# Altium project FMC_ADC_100M_10B_16CHA_TDC.PrjPCB (part 5 of 5)
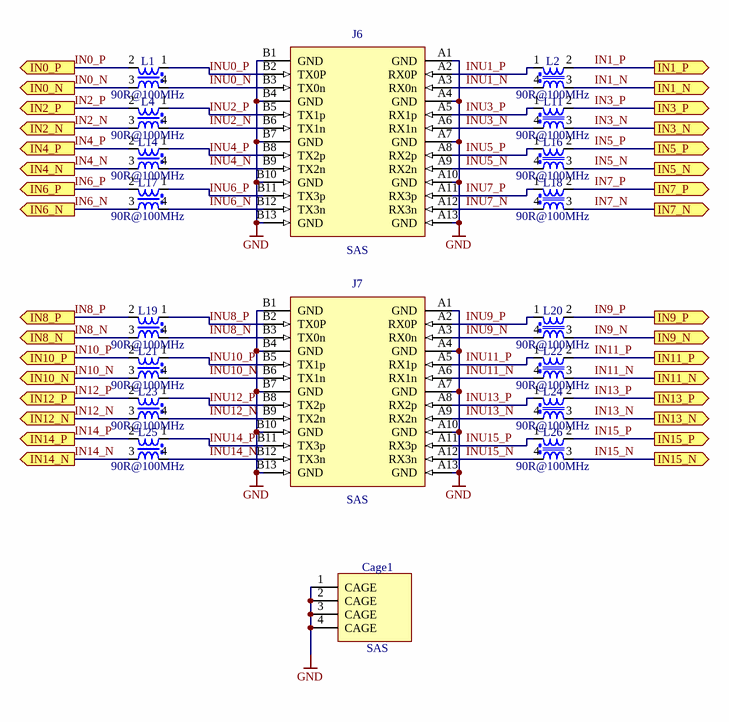
[diagram p12: SAS_Connectors.SchDoc]

## Nets that join several sheets
3P3VAUX: EEPROM_Temp (12 pins), FMC connector (J9.d32)
DVDD33: U_TDC0 (7 pins), power_supply (L8.2), IDX_CTRL (C103.1 C104.1 D1.2 IC17.8), U_TDC1 (7 pins), U_TDC2 (7 pins), U_TDC3 (7 pins), U_CFD0 (C26A.1 IC15A.5), DACs (9 pins), U_CFD1 (C26B.1 IC15B.5), U_CFD2 (C26C.1 IC15C.5), U_CFD3 (C26D.1 IC15D.5), U_CFD4 (C26E.1 IC15E.5), U_CFD5 (C26F.1 IC15F.5), U_CFD6 (C26G.1 IC15G.5), U_CFD7 (C26H.1 IC15H.5), U_CFD8 (C26I.1 IC15I.5), U_CFD9 (C26J.1 IC15J.5), U_CFD10 (C26K.1 IC15K.5), U_CFD11 (C26L.1 IC15L.5), U_CFD12 (C26M.1 IC15M.5), U_CFD13 (C26N.1 IC15N.5), U_CFD14 (C26O.1 IC15O.5), U_CFD15 (C26P.1 IC15P.5), Translators (9 pins)
GND: FMC_ADC_100M_10B_16CHA_TDC (J2.2 R3.1), U_ADC0 (19 pins), U_TDC0 (24 pins), Clock_circuit (34 pins), EEPROM_Temp (14 pins), FMC connector (164 pins), power_supply (58 pins), IDX_CTRL (9 pins), U_TDC1 (24 pins), U_TDC2 (24 pins), U_TDC3 (24 pins), U_CFD0 (10 pins), DACs (18 pins), U_CFD1 (10 pins), U_CFD2 (10 pins), U_CFD3 (10 pins), U_CFD4 (10 pins), U_CFD5 (10 pins), U_CFD6 (10 pins), U_CFD7 (10 pins), U_CFD8 (10 pins), U_CFD9 (10 pins), U_CFD10 (10 pins), U_CFD11 (10 pins), U_CFD12 (10 pins), U_CFD13 (10 pins), U_CFD14 (10 pins), U_CFD15 (10 pins), U_ADC1 (19 pins), Translators (18 pins), SAS_Connectors (24 pins)
N3V0A: power_supply (L30.2 TP9.1), U_CFD0 (C24A.1 IC22A.6), U_CFD1 (C24B.1 IC22B.6), U_CFD2 (C24C.1 IC22C.6), U_CFD3 (C24D.1 IC22D.6), U_CFD4 (C24E.1 IC22E.6), U_CFD5 (C24F.1 IC22F.6), U_CFD6 (C24G.1 IC22G.6), U_CFD7 (C24H.1 IC22H.6), U_CFD8 (C24I.1 IC22I.6), U_CFD9 (C24J.1 IC22J.6), U_CFD10 (C24K.1 IC22K.6), U_CFD11 (C24L.1 IC22L.6), U_CFD12 (C24M.1 IC22M.6), U_CFD13 (C24N.1 IC22N.6), U_CFD14 (C24O.1 IC22O.6), U_CFD15 (C24P.1 IC22P.6)
P1V8: U_ADC0 (C3A.2 IC1A.35 IC4A.5 L12A.1), Clock_circuit (L10.1), power_supply (8 pins), IDX_CTRL (L31.1), U_ADC1 (C3B.2 IC1B.35 IC4B.5 L12B.1), Translators (C66.1 C79.1 IC25.11 IC27.11)
P3V3: FMC connector (5 pins), power_supply (8 pins)
P3V3_CLK: Clock_circuit (38 pins), power_supply (L5.2 TP4.1)
P5V0A: power_supply (L9.2 TP2.1), U_CFD0 (C23A.1 IC22A.3), U_CFD1 (C23B.1 IC22B.3), U_CFD2 (C23C.1 IC22C.3), U_CFD3 (C23D.1 IC22D.3), U_CFD4 (C23E.1 IC22E.3), U_CFD5 (C23F.1 IC22F.3), U_CFD6 (C23G.1 IC22G.3), U_CFD7 (C23H.1 IC22H.3), U_CFD8 (C23I.1 IC22I.3), U_CFD9 (C23J.1 IC22J.3), U_CFD10 (C23K.1 IC22K.3), U_CFD11 (C23L.1 IC22L.3), U_CFD12 (C23M.1 IC22M.3), U_CFD13 (C23N.1 IC22N.3), U_CFD14 (C23O.1 IC22O.3), U_CFD15 (C23P.1 IC22P.3)
P12V0: FMC connector (J9.c35 J9.c37), power_supply (7 pins)
REF2V5: FMC_ADC_100M_10B_16CHA_TDC (R2.1), DACs (C87.1 IC18.8 IC19.8 IC20.2)
VADJ: FMC connector (J9.e39 J9.f40 J9.g39 J9.h40), power_supply (R49.1), Translators (19 pins)
ADC_CLK_N: U_ADC0 (C2A.1 R1A.1), Clock_circuit (IC3.41)
ADC_CLK_N: Clock_circuit (IC3.38), U_ADC1 (C2B.1 R1B.1)
ADC_CLK_P: U_ADC0 (C1A.1 R1A.2), Clock_circuit (IC3.40)
ADC_CLK_P: Clock_circuit (IC3.37), U_ADC1 (C1B.1 R1B.2)
ADC_IN0.SIG_N: U_ADC0 (IC1A.2), U_CFD0 (C27A.1 R25A.2)
ADC_IN0.SIG_P: U_ADC0 (IC1A.1), U_CFD0 (R7A.2 R21A.2)
ADC_IN1.SIG_N: U_ADC0 (IC1A.5), U_CFD1 (C27B.1 R25B.2)
ADC_IN1.SIG_P: U_ADC0 (IC1A.4), U_CFD1 (R7B.2 R21B.2)
ADC_IN2.SIG_N: U_ADC0 (IC1A.8), U_CFD2 (C27C.1 R25C.2)
ADC_IN2.SIG_P: U_ADC0 (IC1A.7), U_CFD2 (R7C.2 R21C.2)
ADC_IN3.SIG_N: U_ADC0 (IC1A.11), U_CFD3 (C27D.1 R25D.2)
ADC_IN3.SIG_P: U_ADC0 (IC1A.10), U_CFD3 (R7D.2 R21D.2)
ADC_IN4.SIG_N: U_ADC0 (IC1A.39), U_CFD4 (C27E.1 R25E.2)
ADC_IN4.SIG_P: U_ADC0 (IC1A.38), U_CFD4 (R7E.2 R21E.2)
ADC_IN5.SIG_N: U_ADC0 (IC1A.42), U_CFD5 (C27F.1 R25F.2)
ADC_IN5.SIG_P: U_ADC0 (IC1A.41), U_CFD5 (R7F.2 R21F.2)
ADC_IN6.SIG_N: U_ADC0 (IC1A.45), U_CFD6 (C27G.1 R25G.2)
ADC_IN6.SIG_P: U_ADC0 (IC1A.44), U_CFD6 (R7G.2 R21G.2)
ADC_IN7.SIG_N: U_ADC0 (IC1A.48), U_CFD7 (C27H.1 R25H.2)
ADC_IN7.SIG_P: U_ADC0 (IC1A.47), U_CFD7 (R7H.2 R21H.2)
ADC_IN8.SIG_N: U_CFD8 (C27I.1 R25I.2), U_ADC1 (IC1B.2)
ADC_IN8.SIG_P: U_CFD8 (R7I.2 R21I.2), U_ADC1 (IC1B.1)
ADC_IN9.SIG_N: U_CFD9 (C27J.1 R25J.2), U_ADC1 (IC1B.5)
ADC_IN9.SIG_P: U_CFD9 (R7J.2 R21J.2), U_ADC1 (IC1B.4)
ADC_IN10.SIG_N: U_CFD10 (C27K.1 R25K.2), U_ADC1 (IC1B.8)
ADC_IN10.SIG_P: U_CFD10 (R7K.2 R21K.2), U_ADC1 (IC1B.7)
ADC_IN11.SIG_N: U_CFD11 (C27L.1 R25L.2), U_ADC1 (IC1B.11)
ADC_IN11.SIG_P: U_CFD11 (R7L.2 R21L.2), U_ADC1 (IC1B.10)
ADC_IN12.SIG_N: U_CFD12 (C27M.1 R25M.2), U_ADC1 (IC1B.39)
ADC_IN12.SIG_P: U_CFD12 (R7M.2 R21M.2), U_ADC1 (IC1B.38)
ADC_IN13.SIG_N: U_CFD13 (C27N.1 R25N.2), U_ADC1 (IC1B.42)
ADC_IN13.SIG_P: U_CFD13 (R7N.2 R21N.2), U_ADC1 (IC1B.41)
ADC_IN14.SIG_N: U_CFD14 (C27O.1 R25O.2), U_ADC1 (IC1B.45)
ADC_IN14.SIG_P: U_CFD14 (R7O.2 R21O.2), U_ADC1 (IC1B.44)
ADC_IN15.SIG_N: U_CFD15 (C27P.1 R25P.2), U_ADC1 (IC1B.48)
ADC_IN15.SIG_P: U_CFD15 (R7P.2 R21P.2), U_ADC1 (IC1B.47)
ADC_MISO: U_ADC0 (IC4A.4), U_ADC1 (IC4B.4), Translators (IC21.7)
ADC_MISO_VADJ: FMC connector (J9.h16), Translators (IC21.5 TP16.1)
ADC_MOSI: U_ADC0 (IC1A.62), U_ADC1 (IC1B.62), Translators (IC21.8)
ADC_MOSI_VADJ: FMC connector (J9.h17), Translators (IC21.4 TP11.1)
ADC_RESETn_1V8: U_ADC0 (IC1A.64), U_ADC1 (IC1B.64), Translators (IC25.10)
ADC_SCK: U_ADC0 (IC1A.63), U_ADC1 (IC1B.63), Translators (IC21.9)
ADC_SCK_VADJ: FMC connector (J9.h32), Translators (IC21.3 IC28.4 R178.1 TP10.1)
ADC_SSN0: U_ADC0 (IC1A.61 IC4A.1), Translators (IC21.10)
ADC_SSN0_VADJ: FMC connector (J9.c14), Translators (IC21.2 TP29.1)
ADC_SSN1: U_ADC1 (IC1B.61 IC4B.1), Translators (IC25.7)
ADC_SSN1_VADJ: FMC connector (J9.c15), Translators (IC25.5 TP20.1)
ADC_SYNC_1V8: U_ADC0 (IC1A.49), U_ADC1 (IC1B.49), Translators (IC27.10)
ADCLK_N: U_ADC0 (IC1A.24), FMC connector (J9.g7)
ADCLK_N: FMC connector (J9.d21), U_ADC1 (IC1B.24)
ADCLK_P: U_ADC0 (IC1A.23), FMC connector (J9.g6)
ADCLK_P: FMC connector (J9.d20), U_ADC1 (IC1B.23)
CFD_CLAMP: FMC_ADC_100M_10B_16CHA_TDC (R2.2 R3.2), U_CFD0 (IC22A.7), U_CFD1 (IC22B.7), U_CFD2 (IC22C.7), U_CFD3 (IC22D.7), U_CFD4 (IC22E.7), U_CFD5 (IC22F.7), U_CFD6 (IC22G.7), U_CFD7 (IC22H.7), U_CFD8 (IC22I.7), U_CFD9 (IC22J.7), U_CFD10 (IC22K.7), U_CFD11 (IC22L.7), U_CFD12 (IC22M.7), U_CFD13 (IC22N.7), U_CFD14 (IC22O.7), U_CFD15 (IC22P.7)
CFD_OFFSET0: U_CFD0 (R120A.1), DACs (IC18.3)
CFD_OFFSET1: DACs (IC18.16), U_CFD1 (R120B.1)
CFD_OFFSET2: DACs (IC18.4), U_CFD2 (R120C.1)
CFD_OFFSET3: DACs (IC18.15), U_CFD3 (R120D.1)
CFD_OFFSET4: DACs (IC18.5), U_CFD4 (R120E.1)
CFD_OFFSET5: DACs (IC18.14), U_CFD5 (R120F.1)
CFD_OFFSET6: DACs (IC18.6), U_CFD6 (R120G.1)
CFD_OFFSET7: DACs (IC18.13), U_CFD7 (R120H.1)
CFD_OFFSET8: DACs (IC19.3), U_CFD8 (R120I.1)
CFD_OFFSET9: DACs (IC19.16), U_CFD9 (R120J.1)
CFD_OFFSET10: DACs (IC19.4), U_CFD10 (R120K.1)
CFD_OFFSET11: DACs (IC19.15), U_CFD11 (R120L.1)
CFD_OFFSET12: DACs (IC19.5), U_CFD12 (R120M.1)
CFD_OFFSET13: DACs (IC19.14), U_CFD13 (R120N.1)
CFD_OFFSET14: DACs (IC19.6), U_CFD14 (R120O.1)
CFD_OFFSET15: DACs (IC19.13), U_CFD15 (R120P.1)
CFD_OUT0.SIG_N: U_TDC0 (IC8A.48 R126A.2), U_CFD0 (IC15A.3)
CFD_OUT0.SIG_P: U_TDC0 (IC8A.33 IC8A.47 R126A.1 R129A.1), U_CFD0 (IC15A.4), U_CFD3 (IC15D.4)
CFD_OUT1.SIG_N: U_TDC0 (IC8A.46 R127A.2), U_CFD1 (IC15B.3)
CFD_OUT1.SIG_P: U_TDC0 (IC8A.45 R127A.1), U_CFD1 (IC15B.4)
CFD_OUT2.SIG_N: U_TDC0 (IC8A.36 R128A.2), U_CFD2 (IC15C.3)
CFD_OUT2.SIG_P: U_TDC0 (IC8A.35 R128A.1), U_CFD2 (IC15C.4)
CFD_OUT3.SIG_N: U_TDC0 (IC8A.34 R129A.2), U_CFD3 (IC15D.3)
CFD_OUT4.SIG_N: U_TDC1 (IC8B.48 R126B.2), U_CFD4 (IC15E.3)
CFD_OUT4.SIG_P: U_TDC1 (IC8B.33 IC8B.47 R126B.1 R129B.1), U_CFD4 (IC15E.4), U_CFD7 (IC15H.4)
CFD_OUT5.SIG_N: U_TDC1 (IC8B.46 R127B.2), U_CFD5 (IC15F.3)
CFD_OUT5.SIG_P: U_TDC1 (IC8B.45 R127B.1), U_CFD5 (IC15F.4)
CFD_OUT6.SIG_N: U_TDC1 (IC8B.36 R128B.2), U_CFD6 (IC15G.3)
CFD_OUT6.SIG_P: U_TDC1 (IC8B.35 R128B.1), U_CFD6 (IC15G.4)
CFD_OUT7.SIG_N: U_TDC1 (IC8B.34 R129B.2), U_CFD7 (IC15H.3)
CFD_OUT8.SIG_N: U_TDC2 (IC8C.48 R126C.2), U_CFD8 (IC15I.3)
CFD_OUT9.SIG_N: U_TDC2 (IC8C.46 R127C.2), U_CFD9 (IC15J.3)
CFD_OUT9.SIG_P: U_TDC2 (IC8C.45 R127C.1), U_CFD9 (IC15J.4)
CFD_OUT10.SIG_N: U_TDC2 (IC8C.36 R128C.2), U_CFD10 (IC15K.3)
CFD_OUT10.SIG_P: U_TDC2 (IC8C.35 R128C.1), U_CFD10 (IC15K.4)
CFD_OUT11.SIG_N: U_TDC2 (IC8C.34 R129C.2), U_CFD11 (IC15L.3)
CFD_OUT11.SIG_P: U_TDC2 (IC8C.33 IC8C.47 R126C.1 R129C.1), U_CFD8 (IC15I.4), U_CFD11 (IC15L.4)
CFD_OUT12.SIG_N: U_TDC3 (IC8D.48 R126D.2), U_CFD12 (IC15M.3)
CFD_OUT12.SIG_P: U_TDC3 (IC8D.33 IC8D.47 R126D.1 R129D.1), U_CFD12 (IC15M.4), U_CFD15 (IC15P.4)
CFD_OUT13.SIG_N: U_TDC3 (IC8D.46 R127D.2), U_CFD13 (IC15N.3)
CFD_OUT13.SIG_P: U_TDC3 (IC8D.45 R127D.1), U_CFD13 (IC15N.4)
CFD_OUT14.SIG_N: U_TDC3 (IC8D.36 R128D.2), U_CFD14 (IC15O.3)
CFD_OUT14.SIG_P: U_TDC3 (IC8D.35 R128D.1), U_CFD14 (IC15O.4)
CFD_OUT15.SIG_N: U_TDC3 (IC8D.34 R129D.2), U_CFD15 (IC15P.3)
CLK0_M2C_N: Clock_circuit (IC3.32), FMC connector (J9.h5)
CLK0_M2C_P: Clock_circuit (IC3.31), FMC connector (J9.h4)
CLK1_M2C_N: Clock_circuit (IC3.35), FMC connector (J9.g3)
CLK1_M2C_P: Clock_circuit (IC3.34), FMC connector (J9.g2)
DISABLE_N: U_TDC0 (IC8A.39 R125A.2), FMC connector (J9.e19)
DISABLE_N: FMC connector (J9.j22), U_TDC2 (IC8C.39 R125C.2)
DISABLE_N: FMC connector (J9.k20), U_TDC1 (IC8B.39 R125B.2)
DISABLE_N: FMC connector (J9.k23), U_TDC3 (IC8D.39 R125D.2)
DISABLE_P: U_TDC0 (IC8A.38 R125A.1), FMC connector (J9.e18)
DISABLE_P: FMC connector (J9.j21), U_TDC2 (IC8C.38 R125C.1)
DISABLE_P: FMC connector (J9.k19), U_TDC1 (IC8B.38 R125B.1)
DISABLE_P: FMC connector (J9.k22), U_TDC3 (IC8D.38 R125D.1)
FRAME0_N: U_TDC0 (IC8A.1), FMC connector (J9.j19)
FRAME0_N: FMC connector (J9.e10), U_TDC3 (IC8D.1)
FRAME0_N: FMC connector (J9.f23), U_TDC2 (IC8C.1)
FRAME0_N: FMC connector (J9.k35), U_TDC1 (IC8B.1)
FRAME0_P: U_TDC0 (IC8A.2), FMC connector (J9.j18)
FRAME0_P: FMC connector (J9.e9), U_TDC3 (IC8D.2)
FRAME0_P: FMC connector (J9.f22), U_TDC2 (IC8C.2)
FRAME0_P: FMC connector (J9.k34), U_TDC1 (IC8B.2)
FRAME1_N: U_TDC0 (IC8A.5), FMC connector (J9.f17)
FRAME1_N: FMC connector (J9.f26), U_TDC2 (IC8C.5)
FRAME1_N: FMC connector (J9.j10), U_TDC3 (IC8D.5)
FRAME1_N: FMC connector (J9.j34), U_TDC1 (IC8B.5)
FRAME1_P: U_TDC0 (IC8A.6), FMC connector (J9.f16)
FRAME1_P: FMC connector (J9.f25), U_TDC2 (IC8C.6)
FRAME1_P: FMC connector (J9.j9), U_TDC3 (IC8D.6)
FRAME1_P: FMC connector (J9.j33), U_TDC1 (IC8B.6)
FRAME2_N: U_TDC0 (IC8A.9), FMC connector (J9.e13)
FRAME2_N: FMC connector (J9.e7), U_TDC3 (IC8D.9)
FRAME2_N: FMC connector (J9.e25), U_TDC2 (IC8C.9)
FRAME2_N: FMC connector (J9.e36), U_TDC1 (IC8B.9)
FRAME2_P: U_TDC0 (IC8A.10), FMC connector (J9.e12)
FRAME2_P: FMC connector (J9.e6), U_TDC3 (IC8D.10)
FRAME2_P: FMC connector (J9.e24), U_TDC2 (IC8C.10)
FRAME2_P: FMC connector (J9.f38), U_TDC1 (IC8B.10)
FRAME3_N: U_TDC0 (IC8A.13), FMC connector (J9.j13)
FRAME3_N: FMC connector (J9.e34), U_TDC1 (IC8B.13)
FRAME3_N: FMC connector (J9.f29), U_TDC2 (IC8C.13)
FRAME3_N: FMC connector (J9.j7), U_TDC3 (IC8D.13)
FRAME3_P: U_TDC0 (IC8A.14), FMC connector (J9.j12)
FRAME3_P: FMC connector (J9.e33), U_TDC1 (IC8B.14)
FRAME3_P: FMC connector (J9.f28), U_TDC2 (IC8C.14)
FRAME3_P: FMC connector (J9.j6), U_TDC3 (IC8D.14)
GA0: EEPROM_Temp (IC5.2), FMC connector (J9.c34)
GA1: EEPROM_Temp (IC5.1), FMC connector (J9.d35)
HA00_CC_N: FMC connector (J9.f5), U_TDC3 (IC8D.17)
HA00_CC_P: FMC connector (J9.f4), U_TDC3 (IC8D.18)
HA01_CC_N: U_TDC0 (IC8A.17), FMC connector (J9.e3)
HA01_CC_P: U_TDC0 (IC8A.18), FMC connector (J9.e2)
HA02_N: FMC connector (J9.k8), U_TDC3 (IC8D.15)
HA02_P: FMC connector (J9.k7), U_TDC3 (IC8D.16)
HA04_N: FMC connector (J9.f8), U_TDC3 (IC8D.11)
HA04_P: FMC connector (J9.f7), U_TDC3 (IC8D.12)
HA06_N: FMC connector (J9.k11), U_TDC3 (IC8D.7)
HA06_P: FMC connector (J9.k10), U_TDC3 (IC8D.8)
HA08_N: FMC connector (J9.f11), U_TDC3 (IC8D.3)
HA08_P: FMC connector (J9.f10), U_TDC3 (IC8D.4)
HA10_N: U_TDC0 (IC8A.15), FMC connector (J9.k14)
HA10_P: U_TDC0 (IC8A.16), FMC connector (J9.k13)
HA12_N: U_TDC0 (IC8A.11), FMC connector (J9.f14)
HA12_P: U_TDC0 (IC8A.12), FMC connector (J9.f13)
HA14_N: U_TDC0 (IC8A.7), FMC connector (J9.j16)
HA14_P: U_TDC0 (IC8A.8), FMC connector (J9.j15)
HA16_N: U_TDC0 (IC8A.3), FMC connector (J9.e16)
HA16_P: U_TDC0 (IC8A.4), FMC connector (J9.e15)
HB00_CC_N: FMC connector (J9.k26), U_TDC2 (IC8C.17)
HB00_CC_P: FMC connector (J9.k25), U_TDC2 (IC8C.18)
HB01_N: FMC connector (J9.j25), U_TDC2 (IC8C.3)
HB01_P: FMC connector (J9.j24), U_TDC2 (IC8C.4)
HB03_N: FMC connector (J9.e22), U_TDC2 (IC8C.7)
HB03_P: FMC connector (J9.e21), U_TDC2 (IC8C.8)
HB06_CC_N: FMC connector (J9.k29), U_TDC2 (IC8C.11)
HB06_CC_P: FMC connector (J9.k28), U_TDC2 (IC8C.12)
HB07_N: FMC connector (J9.j28), U_TDC2 (IC8C.15)
HB07_P: FMC connector (J9.j27), U_TDC2 (IC8C.16)
HB09_N: FMC connector (J9.e28), Translators (R55.2)
HB09_P: FMC connector (J9.e27), Translators (R51.2)
HB10_N: FMC connector (J9.k32), Translators (R57.2)
HB10_P: FMC connector (J9.k31), Translators (R56.2)
HB11_N: FMC connector (J9.j31), Translators (R59.2)
HB11_P: FMC connector (J9.j30), Translators (R58.2)
HB12_N: FMC connector (J9.f32), Translators (R61.2)
HB12_P: FMC connector (J9.f31), Translators (R60.2)
HB13_N: FMC connector (J9.e31), U_TDC1 (IC8B.3)
HB13_P: FMC connector (J9.e30), U_TDC1 (IC8B.4)
HB16_N: FMC connector (J9.f35), U_TDC1 (IC8B.7)
HB16_P: FMC connector (J9.f34), U_TDC1 (IC8B.8)
HB17_CC_N: FMC connector (J9.k38), U_TDC1 (IC8B.17)
HB17_CC_P: FMC connector (J9.k37), U_TDC1 (IC8B.18)
HB18_N: FMC connector (J9.j37), U_TDC1 (IC8B.15)
HB18_P: FMC connector (J9.j36), U_TDC1 (IC8B.16)
HB20_P: FMC connector (J9.f37), U_TDC1 (IC8B.11)
IDC_INT0: U_TDC0 (IC8A.55), Translators (R51.1)
IDX0.SIG_N: U_TDC0 (IC8A.43 R130A.2), IDX_CTRL (IC14.10)
IDX0.SIG_P: U_TDC0 (IC8A.42 R130A.1), IDX_CTRL (IC14.9)
IDX1.SIG_N: IDX_CTRL (IC14.12), U_TDC1 (IC8B.43 R130B.2)
IDX1.SIG_P: IDX_CTRL (IC14.11), U_TDC1 (IC8B.42 R130B.1)
IDX2.SIG_N: IDX_CTRL (IC14.14), U_TDC2 (IC8C.43 R130C.2)
IDX2.SIG_P: IDX_CTRL (IC14.13), U_TDC2 (IC8C.42 R130C.1)
IDX3.SIG_N: IDX_CTRL (IC14.16), U_TDC3 (IC8D.43 R130D.2)
IDX3.SIG_P: IDX_CTRL (IC14.15), U_TDC3 (IC8D.42 R130D.1)
IDX_N: FMC connector (J9.h20), IDX_CTRL (IC14.4 R50.2)
IDX_P: FMC connector (J9.h19), IDX_CTRL (IC14.3 R50.1)
IDX_SRC_SEL_1V8: IDX_CTRL (IC14.2), Translators (IC27.9)
IN0_N: U_CFD0 (R111A.1 R114A.1), SAS_Connectors (L1.3)
IN0_P: U_CFD0 (R113A.1 R114A.2), SAS_Connectors (L1.2)
IN1_N: U_CFD1 (R111B.1 R114B.1), SAS_Connectors (L2.3)
IN1_P: U_CFD1 (R113B.1 R114B.2), SAS_Connectors (L2.2)
IN2_N: U_CFD2 (R111C.1 R114C.1), SAS_Connectors (L4.3)
IN2_P: U_CFD2 (R113C.1 R114C.2), SAS_Connectors (L4.2)
IN3_N: U_CFD3 (R111D.1 R114D.1), SAS_Connectors (L11.3)
IN3_P: U_CFD3 (R113D.1 R114D.2), SAS_Connectors (L11.2)
IN4_N: U_CFD4 (R111E.1 R114E.1), SAS_Connectors (L14.3)
IN4_P: U_CFD4 (R113E.1 R114E.2), SAS_Connectors (L14.2)
IN5_N: U_CFD5 (R111F.1 R114F.1), SAS_Connectors (L16.3)
IN5_P: U_CFD5 (R113F.1 R114F.2), SAS_Connectors (L16.2)
IN6_N: U_CFD6 (R111G.1 R114G.1), SAS_Connectors (L17.3)
IN6_P: U_CFD6 (R113G.1 R114G.2), SAS_Connectors (L17.2)
IN7_N: U_CFD7 (R111H.1 R114H.1), SAS_Connectors (L18.3)
IN7_P: U_CFD7 (R113H.1 R114H.2), SAS_Connectors (L18.2)
IN8_N: U_CFD8 (R111I.1 R114I.1), SAS_Connectors (L19.3)
IN8_P: U_CFD8 (R113I.1 R114I.2), SAS_Connectors (L19.2)
IN9_N: U_CFD9 (R111J.1 R114J.1), SAS_Connectors (L20.3)
IN9_P: U_CFD9 (R113J.1 R114J.2), SAS_Connectors (L20.2)
IN10_N: U_CFD10 (R111K.1 R114K.1), SAS_Connectors (L21.3)
IN10_P: U_CFD10 (R113K.1 R114K.2), SAS_Connectors (L21.2)
IN11_N: U_CFD11 (R111L.1 R114L.1), SAS_Connectors (L22.3)
IN11_P: U_CFD11 (R113L.1 R114L.2), SAS_Connectors (L22.2)
IN12_N: U_CFD12 (R111M.1 R114M.1), SAS_Connectors (L23.3)
IN12_P: U_CFD12 (R113M.1 R114M.2), SAS_Connectors (L23.2)
IN13_N: U_CFD13 (R111N.1 R114N.1), SAS_Connectors (L24.3)
IN13_P: U_CFD13 (R113N.1 R114N.2), SAS_Connectors (L24.2)
IN14_N: U_CFD14 (R111O.1 R114O.1), SAS_Connectors (L25.3)
IN14_P: U_CFD14 (R113O.1 R114O.2), SAS_Connectors (L25.2)
IN15_N: U_CFD15 (R111P.1 R114P.1), SAS_Connectors (L26.3)
IN15_P: U_CFD15 (R113P.1 R114P.2), SAS_Connectors (L26.2)
LA01_CC_N: U_ADC0 (IC1A.26), FMC connector (J9.d9)
LA01_CC_P: U_ADC0 (IC1A.25), FMC connector (J9.d8)
LA02_N: U_ADC0 (IC1A.16), FMC connector (J9.h8)
LA02_P: U_ADC0 (IC1A.15), FMC connector (J9.h7)
LA03_N: U_ADC0 (IC1A.18), FMC connector (J9.g10)
LA03_P: U_ADC0 (IC1A.17), FMC connector (J9.g9)
LA04_N: U_ADC0 (IC1A.20), FMC connector (J9.h11)
LA04_P: U_ADC0 (IC1A.19), FMC connector (J9.h10)
LA05_N: U_ADC0 (IC1A.22), FMC connector (J9.d12)
LA05_P: U_ADC0 (IC1A.21), FMC connector (J9.d11)
LA06_N: U_ADC0 (IC1A.28), FMC connector (J9.c11)
LA06_P: U_ADC0 (IC1A.27), FMC connector (J9.c10)
LA07_N: U_ADC0 (IC1A.30), FMC connector (J9.h14)
LA07_P: U_ADC0 (IC1A.29), FMC connector (J9.h13)
LA08_N: U_ADC0 (IC1A.32), FMC connector (J9.g13)
LA08_P: U_ADC0 (IC1A.31), FMC connector (J9.g12)
LA09_N: U_ADC0 (IC1A.34), FMC connector (J9.d15)
LA09_P: U_ADC0 (IC1A.33), FMC connector (J9.d14)
LA12_N: FMC connector (J9.g16), Translators (IC16.4 TP14.1)
LA12_P: FMC connector (J9.g15), Translators (IC16.3 TP13.1)
LA13_N: FMC connector (J9.d18), Translators (IC16.2 TP12.1)
LA13_P: FMC connector (J9.d17), Translators (IC25.3 TP18.1)
LA14_N: FMC connector (J9.c19), Translators (IC25.4 TP19.1)
LA14_P: FMC connector (J9.c18), Translators (IC26.5 TP24.1)
LA16_N: FMC connector (J9.g19), IDX_CTRL (IC14.7 IC17.7 R75.1)
LA16_P: FMC connector (J9.g18), IDX_CTRL (IC14.6 IC17.6 R75.2)
LA18_CC_N: FMC connector (J9.c23), U_ADC1 (IC1B.26)
LA18_CC_P: FMC connector (J9.c22), U_ADC1 (IC1B.25)
LA19_N: FMC connector (J9.h23), U_ADC1 (IC1B.34)
LA19_P: FMC connector (J9.h22), U_ADC1 (IC1B.33)
LA20_N: FMC connector (J9.g22), U_ADC1 (IC1B.32)
LA20_P: FMC connector (J9.g21), U_ADC1 (IC1B.31)
LA21_N: FMC connector (J9.h26), U_ADC1 (IC1B.30)
LA21_P: FMC connector (J9.h25), U_ADC1 (IC1B.29)
LA22_N: FMC connector (J9.g25), U_ADC1 (IC1B.28)
LA22_P: FMC connector (J9.g24), U_ADC1 (IC1B.27)
LA23_N: FMC connector (J9.d24), U_ADC1 (IC1B.22)
LA23_P: FMC connector (J9.d23), U_ADC1 (IC1B.21)
LA24_N: FMC connector (J9.h29), U_ADC1 (IC1B.20)
LA24_P: FMC connector (J9.h28), U_ADC1 (IC1B.19)
LA25_N: FMC connector (J9.g28), U_ADC1 (IC1B.18)
LA25_P: FMC connector (J9.g27), U_ADC1 (IC1B.17)
LA26_N: FMC connector (J9.d27), U_ADC1 (IC1B.16)
LA26_P: FMC connector (J9.d26), U_ADC1 (IC1B.15)
LA27_N: FMC connector (J9.c27), Translators (IC27.4 TP27.1)
LA27_P: FMC connector (J9.c26), Translators (IC26.3 TP22.1)
LA28_P: FMC connector (J9.h31), Translators (IC16.5 IC28.3 R83.1 TP31.1)
LA29_N: FMC connector (J9.g31), power_supply (IC10.3 LD5.1 R49.2)
LA29_P: FMC connector (J9.g30), Translators (IC27.2 TP25.1)
LA31_N: FMC connector (J9.g34), Translators (IC27.5 TP28.1)
LA31_P: FMC connector (J9.g33), Translators (IC25.2 TP17.1)
LA33_N: FMC connector (J9.g37), Translators (IC26.2 TP21.1)
LA33_P: FMC connector (J9.g36), Translators (IC27.3 TP26.1)
LCLKIN_N: U_TDC0 (IC8A.64), Clock_circuit (IC3.68)
LCLKIN_N: Clock_circuit (IC3.47), U_TDC3 (IC8D.64)
LCLKIN_N: Clock_circuit (IC3.53), U_TDC2 (IC8C.64)
LCLKIN_N: Clock_circuit (IC3.61), U_TDC1 (IC8B.64)
LCLKIN_P: U_TDC0 (IC8A.63), Clock_circuit (IC3.67)
LCLKIN_P: Clock_circuit (IC3.46), U_TDC3 (IC8D.63)
LCLKIN_P: Clock_circuit (IC3.52), U_TDC2 (IC8C.63)
LCLKIN_P: Clock_circuit (IC3.62), U_TDC1 (IC8B.63)
NetD1_3: FMC_ADC_100M_10B_16CHA_TDC (J2.1), IDX_CTRL (D1.3 IC17.1 IC17.4 R52.2)
NetIC3_4: Clock_circuit (IC3.4 R48.2), Translators (IC27.7)
NetIC18_19: DACs (IC18.19 IC19.19), Translators (IC28.5 R12.1)
NetIC18_20: DACs (IC18.20 IC19.20), Translators (IC28.6 R10.1)
NetIC27_8: Clock_circuit (R54.1), Translators (IC27.8)
REFA_N: Clock_circuit (IC3.3 R82.2), FMC connector (R27.1)
REFA_P: Clock_circuit (IC3.2 R82.1), FMC connector (R23.1)
REFCLK_N: U_TDC0 (IC8A.41 R131A.2), Clock_circuit (IC3.65)
REFCLK_N: Clock_circuit (IC3.44), U_TDC3 (IC8D.41 R131D.2)
REFCLK_N: Clock_circuit (IC3.50), U_TDC2 (IC8C.41 R131C.2)
REFCLK_N: Clock_circuit (IC3.59), U_TDC1 (IC8B.41 R131B.2)
REFCLK_P: U_TDC0 (IC8A.40 R131A.1), Clock_circuit (IC3.64)
REFCLK_P: Clock_circuit (IC3.43), U_TDC3 (IC8D.40 R131D.1)
REFCLK_P: Clock_circuit (IC3.49), U_TDC2 (IC8C.40 R131C.1)
REFCLK_P: Clock_circuit (IC3.58), U_TDC1 (IC8B.40 R131B.1)
SCL: EEPROM_Temp (IC5.6 R42.2 R44.1), FMC connector (J9.c30)
SDA: EEPROM_Temp (IC5.5 R39.2 R43.1), FMC connector (J9.c31)
TDC_MISO: U_TDC0 (IC8A.59), U_TDC1 (IC8B.59), U_TDC2 (IC8C.59), U_TDC3 (IC8D.59), Translators (IC25.8)
TDC_MOSI: U_TDC0 (IC8A.58), U_TDC1 (IC8B.58), U_TDC2 (IC8C.58), U_TDC3 (IC8D.58), Translators (IC25.9)
TDC_PAR0: U_TDC0 (IC8A.54), Translators (R55.1)
TDC_PAR1: U_TDC1 (IC8B.54), Translators (R57.1)
TDC_PAR2: U_TDC2 (IC8C.54), Translators (R59.1)
TDC_PAR3: U_TDC3 (IC8D.54), Translators (R61.1)
TDC_SCK: U_TDC0 (IC8A.57), U_TDC1 (IC8B.57), U_TDC2 (IC8C.57), U_TDC3 (IC8D.57), Translators (IC26.7)
TDC_SSN0: U_TDC0 (IC8A.56), Translators (IC16.10)
TDC_SSN1: U_TDC1 (IC8B.56), Translators (IC16.9)
TDC_SSN2: U_TDC2 (IC8C.56), Translators (IC16.8)
TDC_SSN3: U_TDC3 (IC8D.56), Translators (IC16.7)
TEMP_ALARM: EEPROM_Temp (IC2.3 IC13.3 R5.1), power_supply (IC7.B2 IC7.D2)
TRIG_DIR: IDX_CTRL (IC17.2 IC17.3), Translators (IC26.10)
TRIG_TERM: IDX_CTRL (T3.5), Translators (IC26.9)
VCM0: U_ADC0 (IC1A.53), U_CFD0 (C89A.1 IC22A.2), U_CFD1 (C89B.1 IC22B.2), U_CFD2 (C89C.1 IC22C.2), U_CFD3 (C89D.1 IC22D.2), U_CFD4 (C89E.1 IC22E.2), U_CFD5 (C89F.1 IC22F.2), U_CFD6 (C89G.1 IC22G.2), U_CFD7 (C89H.1 IC22H.2)
VCM1: U_CFD8 (C89I.1 IC22I.2), U_CFD9 (C89J.1 IC22J.2), U_CFD10 (C89K.1 IC22K.2), U_CFD11 (C89L.1 IC22L.2), U_CFD12 (C89M.1 IC22M.2), U_CFD13 (C89N.1 IC22N.2), U_CFD14 (C89O.1 IC22O.2), U_CFD15 (C89P.1 IC22P.2), U_ADC1 (IC1B.53)